# EAGLE design Edge_Con_461 (EAGLE 7.2.0)
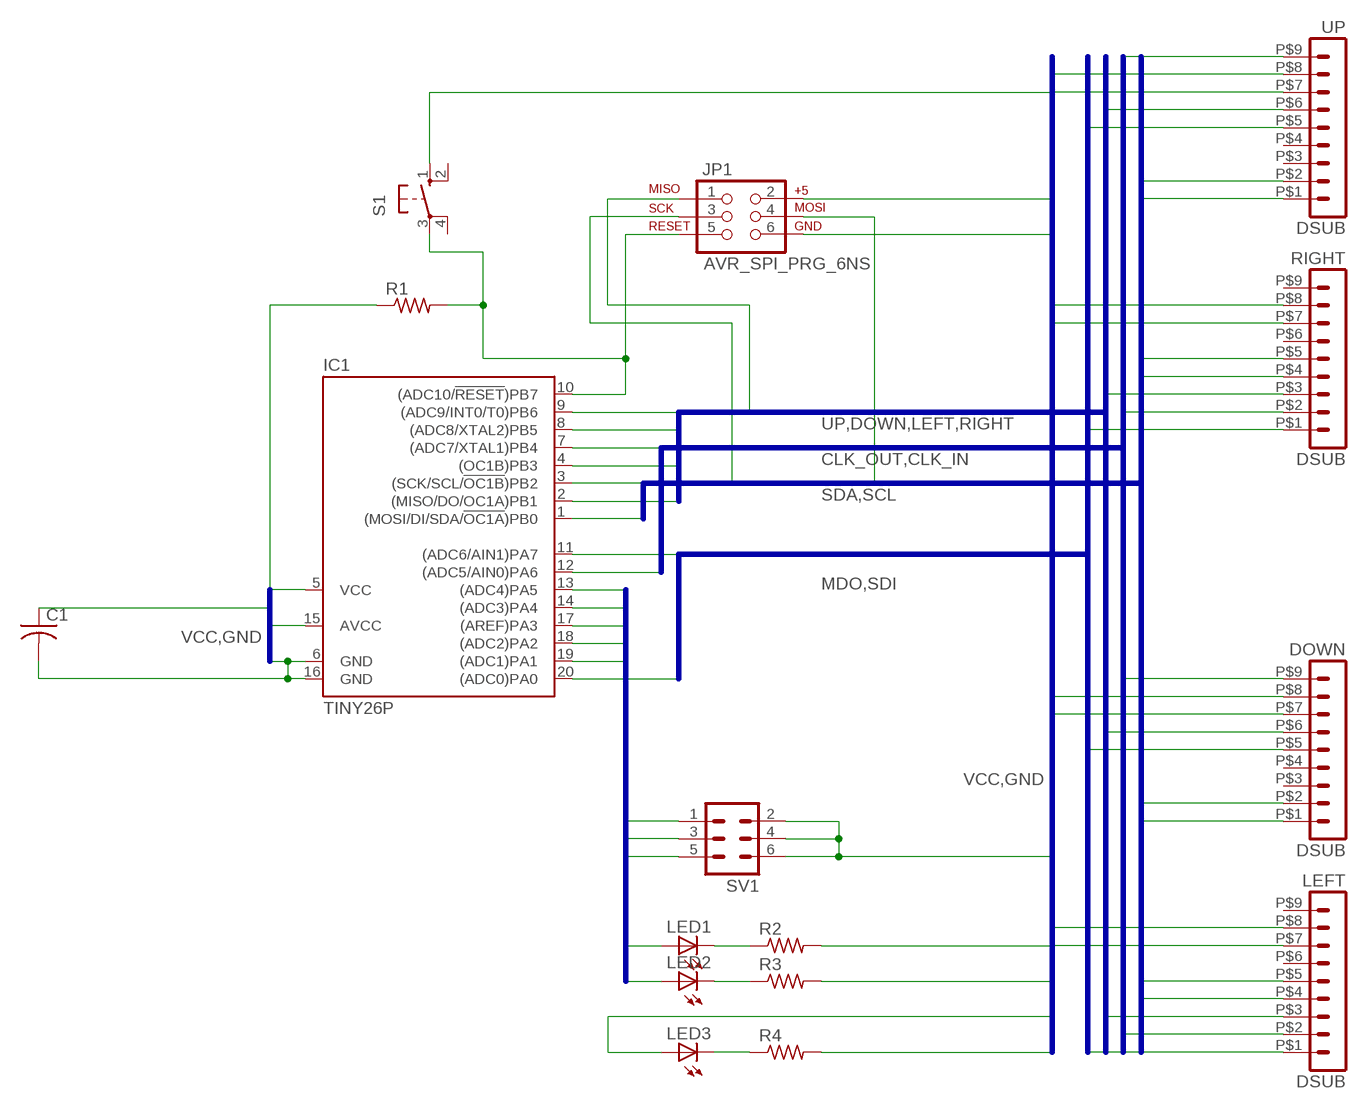
[diagram p0: schematic, sheet 1]

## Parts
C1  C-US025-025X050  [C025-025X050]
DOWN  DSUB  [FOUR]
IC1  TINY26P  [DIL20]
JP1  AVR_SPI_PRG_6NS  [2X3-NS]
LED1  LED3MM  [LED3MM]
LED2  LED3MM  [LED3MM]
LED3  LED3MM  [LED3MM]
LEFT  DSUB  [FOUR]
R1  R-US_0204/5  [0204/5]
R2  R-US_0204/5  [0204/5]
R3  R-US_0204/5  [0204/5]
R4  R-US_0204/5  [0204/5]
RIGHT  DSUB  [FOUR]
S1  10-XX  [B3F-10XX]
SV1  MA03-2  [MA03-2]
UP  DSUB  [FOUR]

## Nets
13: IC1.13((ADC4)PA5) LED1.A
14: IC1.14((ADC3)PA4) LED2.A
17: IC1.17((AREF)PA3) SV1.5
18: IC1.18((ADC2)PA2) SV1.3
19: IC1.19((ADC1)PA1) SV1.1
CLK_IN: DOWN.P$9 IC1.7((ADC7/XTAL1)PB4) LEFT.P$2
CLK_OUT: IC1.12((ADC5/AIN0)PA6) RIGHT.P$2 UP.P$9
DOWN: DOWN.P$6 IC1.4((OC1B)PB3)
GND: C1.2 DOWN.P$7 IC1.6(GND) IC1.16(GND) JP1.6 LEFT.P$7 R2.2 R3.2 R4.2 RIGHT.P$7 S1.1(S) SV1.2 SV1.4 SV1.6 UP.P$7
LEFT: IC1.2((MISO/DO/OC1A)PB1) JP1.1 LEFT.P$3
MDO: IC1.11((ADC6/AIN1)PA7) RIGHT.P$1 UP.P$5
N$1: IC1.10((ADC10/!RESET!)PB7) JP1.5 R1.2 S1.3(P)
N$2: LED3.K(C) R4.1
N$3: LED1.K(C) R2.1
N$4: LED2.K(C) R3.1
RIGHT: IC1.8((ADC8/XTAL2)PB5) RIGHT.P$3
SCL: DOWN.P$2 IC1.3((SCK/SCL/!OC1B!)PB2) JP1.3 LEFT.P$5 RIGHT.P$5 UP.P$2
SDA: DOWN.P$1 IC1.1((MOSI/DI/SDA/!OC1A!)PB0) JP1.4 LEFT.P$4 RIGHT.P$4 UP.P$1
SDI: DOWN.P$5 IC1.20((ADC0)PA0) LEFT.P$1
UP: IC1.9((ADC9/INT0/T0)PB6) UP.P$6
VCC: C1.1 DOWN.P$8 IC1.5(VCC) IC1.15(AVCC) JP1.2 LED3.A LEFT.P$8 R1.1 RIGHT.P$8 UP.P$8
Unconnected: DOWN.P$3 DOWN.P$4 LEFT.P$6 LEFT.P$9 RIGHT.P$6 RIGHT.P$9 S1.2(S1) S1.4(P1) UP.P$3 UP.P$4

## Buses
SDA,SCL
CLK_OUT,CLK_IN
UP,DOWN,LEFT,RIGHT
MDO,SDI
VCC,GND
13,14,16,17,18,19

## Library data of the parts
C1 = rcl:C-US: CAPACITOR, American symbol
DOWN LEFT RIGHT UP = custom:DSUB: Side mount for DB9 connector.
IC1 = atmel:TINY26*: 8-bit AVR Microcontroller with 2K Bytes Flash Source: http://www.atmel.com .. doc1477.pdf; MPN: ATTINY261-20PU; OC_FARNELL: 1455146; OC_NEWARK: 58M3782
JP1 = SparkFun-Connectors:AVR_SPI_PRG_6: AVR ISP 6 Pin This is the reduced ISP connector for AVR programming. Common on Arduino. This footprint will take up less PCB space and can be used with a 10-pin to 6-pin adapter such as SKU: BOB-08508 **Special note about "TEST_POINT" package. The stop mask is on the top side, so if you want your programming test points to be on the bottom of your board, make sure to place this package on the bottom side of the board. This also ensure that the orientation to program from the bottom side will be correct.
LED1-LED3 = led:LED: LED OSRAM: - CHIPLED LG R971, LG N971, LY N971, LG Q971, LY Q971, LO R971, LY R971 LH N974, LH R974 LS Q976, LO Q976, LY Q976 LO Q996 - Hyper CHIPLED LW Q18S LB Q993, LB Q99A, LB R99A - SideLED LS A670, LO A670, LY A670, LG A670, LP A670 LB A673, LV A673, LT A673, LW A673 LH A674 LY A675 LS A676, LA A676, LO A676, LY A676, LW A676 LS A679, LY A679, LG A679 - Hyper Micro SIDELED® LS Y876, LA Y876, LO Y876, LY Y876 LT Y87S - SmartLED LW L88C, LW L88S LB L89C, LB L89S, LG L890 LS L89K, LO L89K, LY L89K LS L896, LA L896, LO L896, LY L896 - TOPLED LS T670, LO T670, LY T670, LG T670, LP T670 LSG T670, LSP T670, LSY T670, LOP T670, LYG T670 LG T671, LOG T671, LSG T671 LB T673, LV T673, LT T673, LW T673 LH T674 LS T676, LA T676, LO T676, LY T676, LB T676, LH T676, LSB T676, LW T676 LB T67C, LV T67C, LT T67C, LS T67K, LO T67K, LY T67K, LW E67C LS E67B, LA E67B, LO E67B, LY E67B, LB E67C, LV E67C, LT E67C LW T67C LS T679, LY T679, LG T679 LS T770, LO T770, LY T770, LG T770, LP T770 LB T773, LV T773, LT T773, LW T773 LH T774 LS E675, LA E675, LY E675, LS T675 LS T776, LA T776, LO T776, LY T776, LB T776 LHGB T686 LT T68C, LB T68C - Hyper Mini TOPLED® LB M676 - Mini TOPLED Santana® LG M470 LS M47K, LO M47K, LY M47K Source: http://www.osram.convergy.de LUXEON: - LUMILED® LXK2-PW12-R00, LXK2-PW12-S00, LXK2-PW14-U00, LXK2-PW14-V00 LXK2-PM12-R00, LXK2-PM12-S00, LXK2-PM14-U00 LXK2-PE12-Q00, LXK2-PE12-R00, LXK2-PE12-S00, LXK2-PE14-T00, LXK2-PE14-U00 LXK2-PB12-K00, LXK2-PB12-L00, LXK2-PB12-M00, LXK2-PB14-N00, LXK2-PB14-P00, LXK2-PB14-Q00 LXK2-PR12-L00, LXK2-PR12-M00, LXK2-PR14-Q00, LXK2-PR14-R00 LXK2-PD12-Q00, LXK2-PD12-R00, LXK2-PD12-S00 LXK2-PH12-R00, LXK2-PH12-S00 LXK2-PL12-P00, LXK2-PL12-Q00, LXK2-PL12-R00 Source: www.luxeon.com KINGBRIGHT: KA-3528ASYC Source: www.kingbright.com
R1-R4 = rcl:R-US_: RESISTOR, American symbol
S1 = switch-omron:10-XX: OMRON SWITCH; MPN: B3F-1000; OC_FARNELL: 176432; OC_NEWARK: 36M3542
SV1 = con-lstb:MA03-2: PIN HEADER; OC_FARNELL: unknown; OC_NEWARK: unknown

## Board
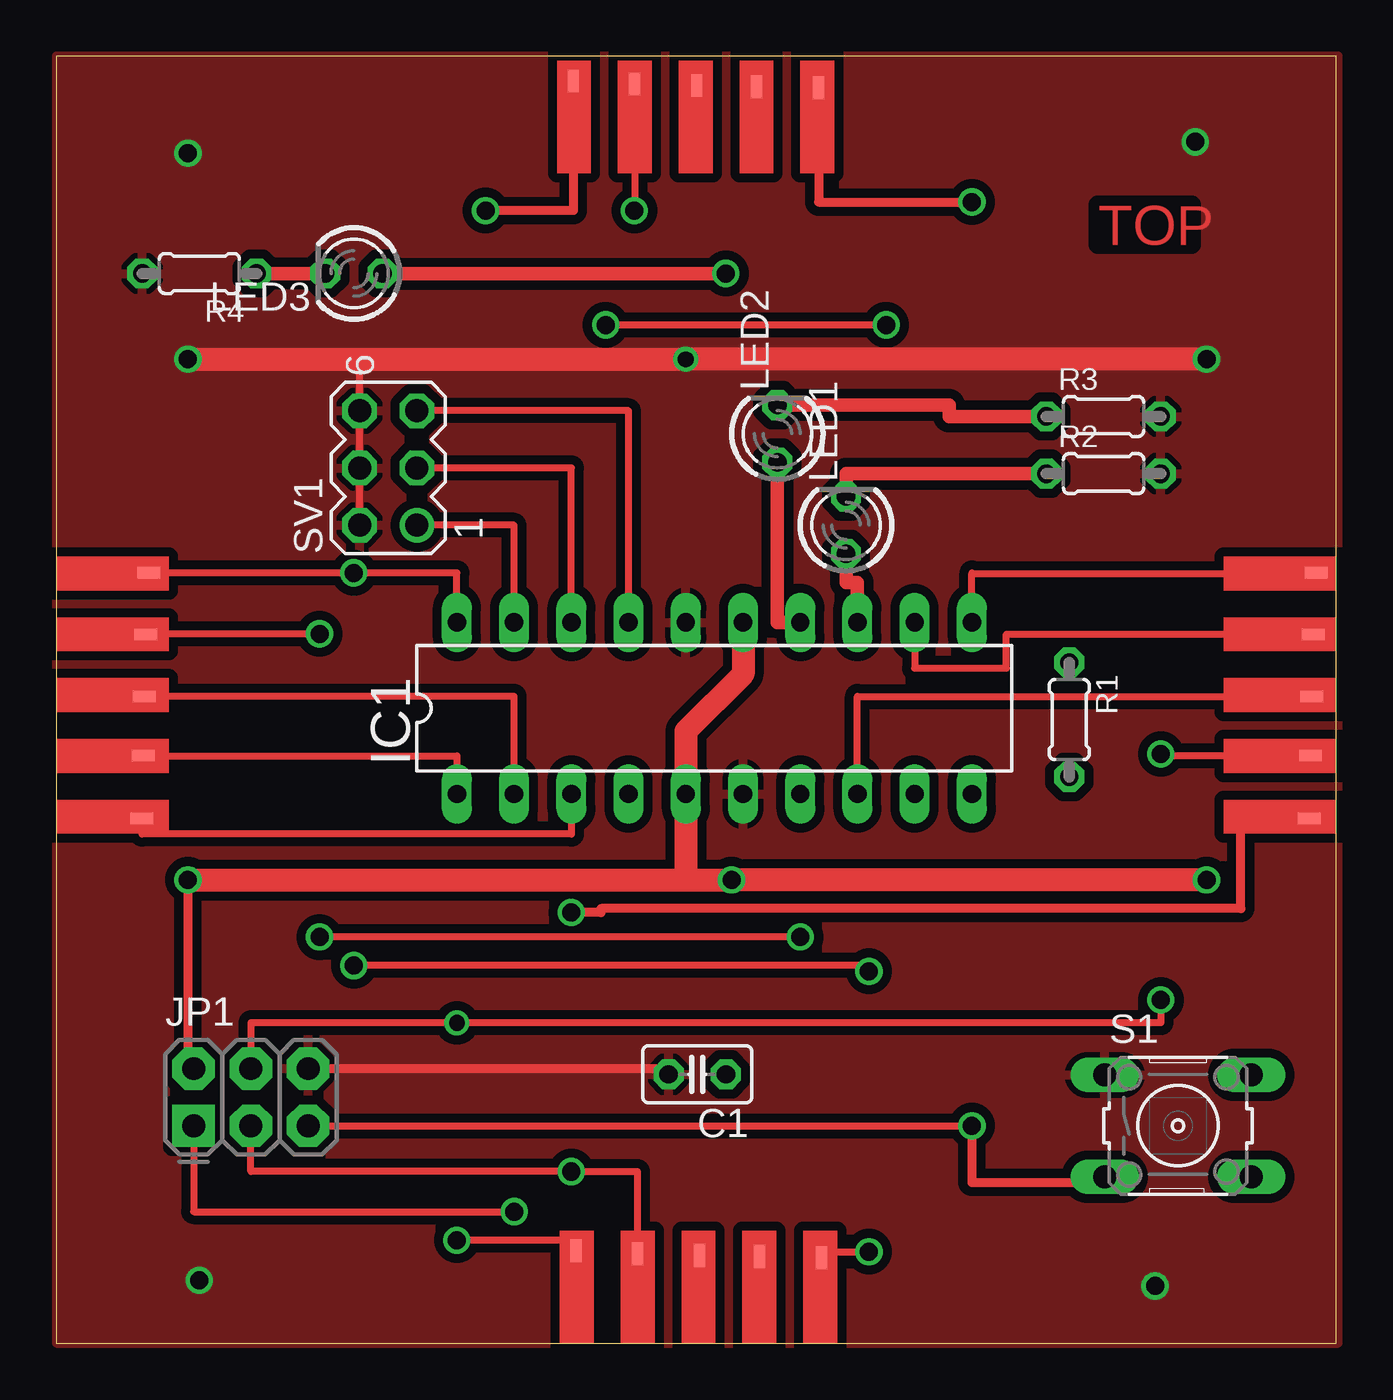
[diagram p1: board, top side]
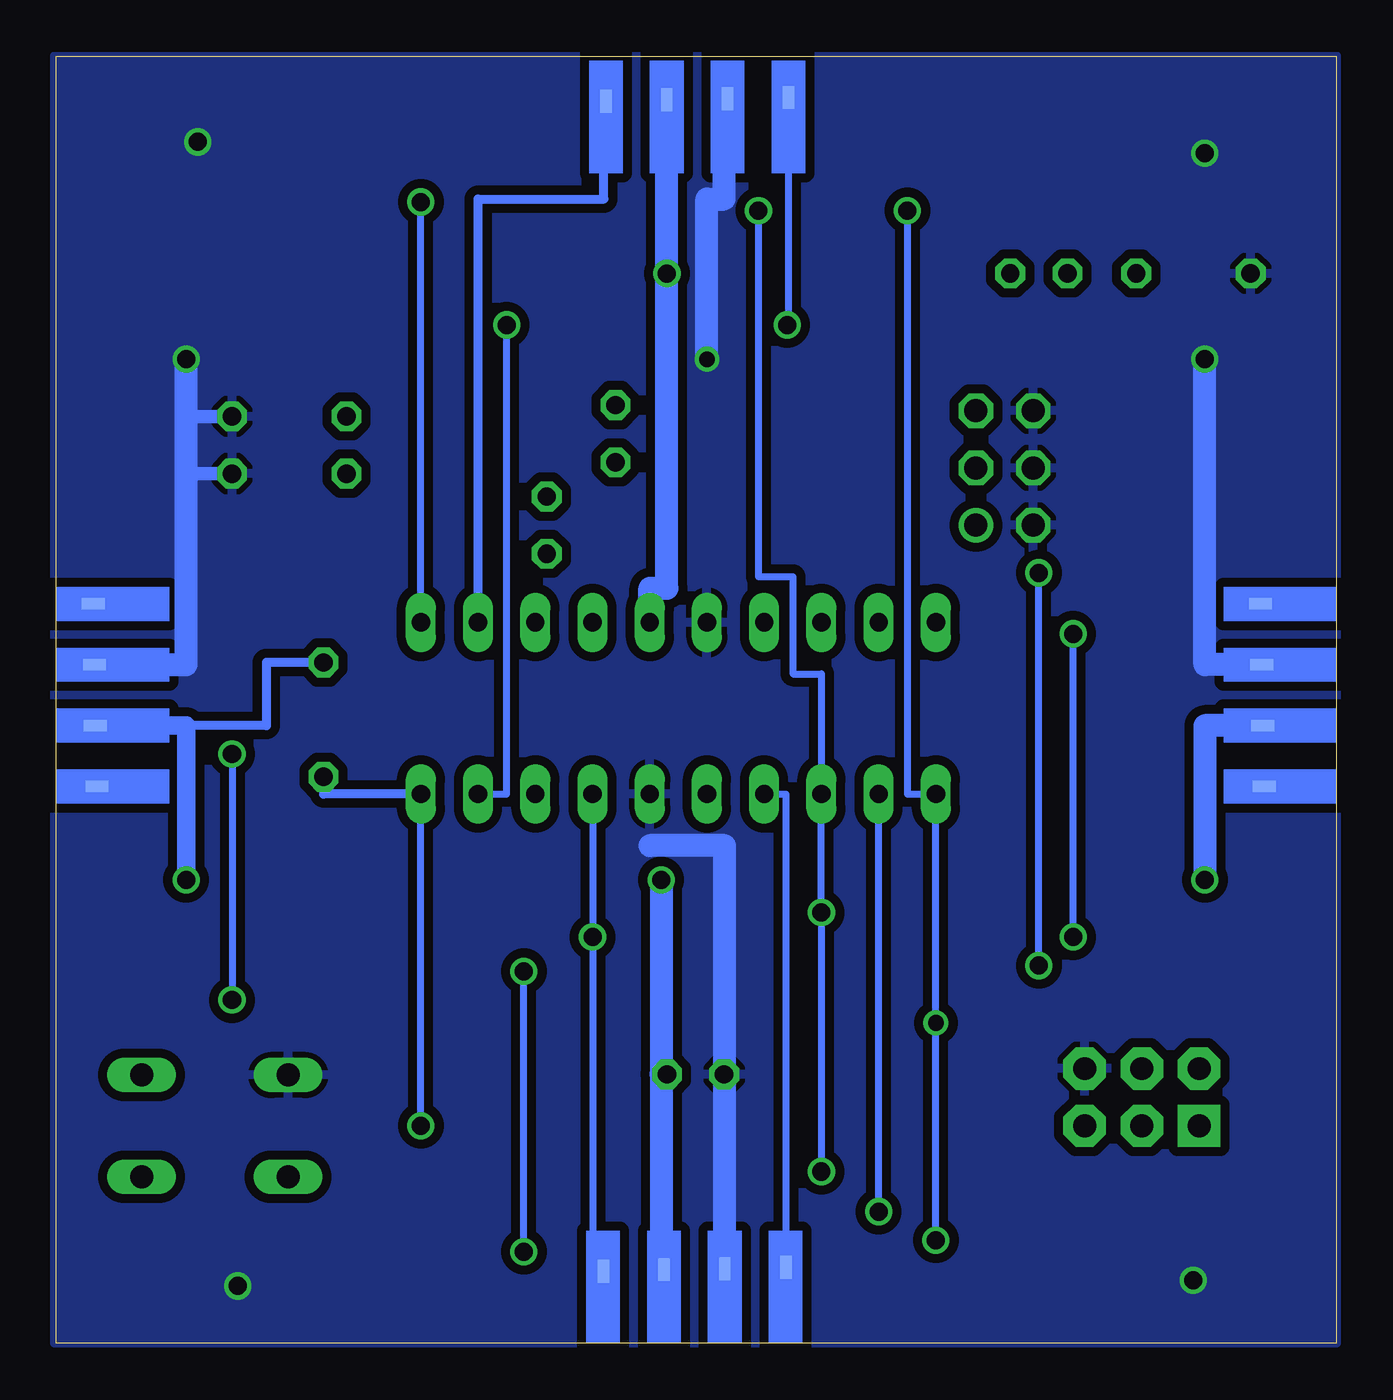
[diagram p2: board, bottom side, seen from below]

Size 56.82 x 57.14 mm. Coordinates in mm from the lower left corner, seen from the top.
Outline: 0,0 56.82,0 56.82,57.14 0,57.14 0,0
Copper layers (1*16): Top 0.035mm / dielectric 1.5mm / Bottom 0.035mm
Design rules "default *": minimum track width 10mil, minimum drill 24mil, track to track 8mil, track to pad 8mil, pad to pad 8mil, via to via 8mil, smd to smd 8mil, copper to edge 0mil, drill to drill 8mil, minimum pad ring 10mil, minimum via ring 8mil, stop-mask expansion 4mil, vias tented up to drill 0mil, thermal gap 10mil

### Footprints (pad centres in the part's own frame; a part is rotated, then mirrored left to right if it is on the bottom)
C025-025X050 = drill 0.813 octagon: 1 -1.27,0; 2 1.27,0
FOUR = smd 0.508 x 1.016: P$1 0.72,4.1; P$2 3.44,3.97; P$3 6.2,3.9; P$4 8.85,3.85; P$5 11.61,3.8 | smd 0.508 x 1.016 bottom: P$6 2.09,3.37; P$7 4.8,3.31; P$8 7.5,3.27; P$9 10.19,3.2
DIL20 = drill 0.813 long: 1 -11.43,-3.81; 2 -8.89,-3.81; 3 -6.35,-3.81; 4 -3.81,-3.81; 5 -1.27,-3.81; 6 1.27,-3.81; 7 3.81,-3.81; 8 6.35,-3.81; 9 8.89,-3.81; 10 11.43,-3.81; 11 11.43,3.81; 12 8.89,3.81; 13 6.35,3.81; 14 3.81,3.81; 15 1.27,3.81; 16 -1.27,3.81; 17 -3.81,3.81; 18 -6.35,3.81; 19 -8.89,3.81; 20 -11.43,3.81
2X3-NS = drill 1.016 pad 1.88 square: 1 -2.54,-1.27 | drill 1.016 pad 1.88 octagon: 2 -2.54,1.27; 3 0,-1.27; 4 0,1.27; 5 2.54,-1.27; 6 2.54,1.27
LED3MM = drill 0.813 octagon: A -1.27,0; K 1.27,0
0204/5 = drill 0.813 octagon: 1 -2.54,0; 2 2.54,0
B3F-10XX = drill 1.016 long: 1 -3.251,2.261; 2 3.251,2.261; 3 -3.251,-2.261; 4 3.251,-2.261
MA03-2 = drill 1.016: 1 -2.54,-1.27 | drill 1.016 octagon: 2 -2.54,1.27; 3 0,-1.27; 4 0,1.27; 5 2.54,-1.27; 6 2.54,1.27

### Placement (x,y rotation side)
C1  28.45,11.94 180 top
DOWN  22.35,0 0 top
IC1  29.21,28.19 0 top
JP1  8.64,10.92 0 top
LED1  35.05,36.32 90 top
LED2  32,40.39 90 top
LED3  13.21,47.5 180 top
LEFT  0,34.92 270 top
R1  44.96,27.69 270 top
R2  46.48,38.61 0 top
R3  46.48,41.15 0 top
R4  6.35,47.5 180 top
RIGHT  51.82,34.92 270 top
S1  49.78,9.65 0 top
SV1  14.73,38.86 90 top
UP  22.23,51.94 0 top

### Tracks (layer width: path | path; a pad name or v marks a point on that pad's centre or on a via)
13
  Top 0.61: LED1.A 35.05,33.78 35.56,33.78 IC1.13
14
  Top 0.61: LED2.A 32,32 IC1.14
17
  Top 0.305: IC1.17 25.4,41.4 SV1.5
18
  Top 0.305: IC1.18 22.86,38.86 SV1.3
19
  Top 0.305: IC1.19 20.32,36.32 SV1.1
CLK_IN  (via drill 0.8)
  Top 0.305: v33.02,18.03 v11.68,18.03 | v11.68,31.5 11.68,31.48 LEFT.P$2
  Bottom 0.305: DOWN.P$9 33.02,3.2 v33.02,18.03 IC1.7 | v11.68,18.03 v11.68,31.5
CLK_OUT
  Top 0.305: IC1.12 38.1,29.97 42.16,29.97 42.16,31.48 RIGHT.P$2
  Bottom 0.406: IC1.12 38.1,50.8 32.51,50.8 32.51,54.1 32.41,54.1 UP.P$9
DOWN
  Bottom 0.305: IC1.4 24.44,24.38 DOWN.P$6
GND  (via drill 0.7, 0.8)
  Top 0.305: SV1.2 SV1.4 SV1.6 13.46,43.69
  Top 0.406: JP1.6 27.18,12.19 | 46.51,11.94 S1.1
  Top 1.016: v5.84,43.69 13.46,43.69 v27.94,43.69 v51.05,43.69
  Bottom 0.61: R3.2 51.05,41.15 | R2.2 51.05,38.61
  Bottom 0.813: 27.18,55.25 UP.P$7
  Bottom 1.016: v27.94,43.69 27.94,50.8 27.18,50.8 27.18,55.25 | LEFT.P$7 5.84,30.12 v5.84,43.69 | RIGHT.P$7 51.05,30.12 51.05,38.61 51.05,41.15 v51.05,43.69 | DOWN.P$7 27.15,11.94 27.15,22.1 30.48,22.1
  other vias: 5.84,52.83 50.55,53.34 48.77,2.54 6.35,2.79
  pour Top (isolate 0.406): 0,0 56.9,0 56.9,0.25 56.9,57.15 0,57.15
  pour Bottom (isolate 0.406): 0,0 56.9,0 56.9,57.15 0,57.15
LEFT  (via drill 0.8)
  Top 0.305: IC1.2 20.32,28.73 LEFT.P$3 | JP1.1 6.1,5.84 v20.32,5.84
  Bottom 0.305: v20.32,5.84 IC1.2
MDO  (via drill 0.8)
  Top 0.305: IC1.11 40.64,34.16 | 40.64,34.2 40.64,34.16 | 40.64,34.16 56.52,34.16 56.52,34.2 RIGHT.P$1
  Top 0.406: UP.P$5 33.84,50.67 v40.64,50.67
  Bottom 0.305: IC1.11 v40.64,50.67
N$1  (via drill 0.8)
  Top 0.305: JP1.5 v40.64,9.65
  Top 0.406: v40.64,9.65 40.64,7.14 46.28,7.14 S1.3
  Bottom 0.305: v40.64,9.65 IC1.10
  Bottom 0.406: IC1.10 44.96,24.38 R1.2
N$2
  Top 0.61: LED3.K R4.1
N$3
  Top 0.61: LED1.K 35.05,38.61 R2.1
N$4
  Top 0.61: R3.1 39.62,41.15 39.62,41.66 LED2.K
RIGHT
  Top 0.305: IC1.8 35.56,28.73 RIGHT.P$3
SCL  (via drill 0.8)
  Top 0.305: IC1.3 22.86,22.61 3.81,22.61 LEFT.P$5 | UP.P$2 25.66,50.29 v25.65,50.29 | DOWN.P$2 25.79,7.62 v22.86,7.62 8.64,7.62 JP1.3
  Top 0.406: RIGHT.P$5 55.62,23.37 52.58,23.37 52.58,19.3 24.18,19.3 24.18,19.13 v22.86,19.13
  Bottom 0.305: v25.65,50.29 25.65,34.04 24.13,34.04 24.13,29.72 22.86,29.72 IC1.3 v22.86,19.13 v22.86,7.62
SDA  (via drill 0.7, 0.8)
  Top 0.305: DOWN.P$1 23.07,4.57 v17.78,4.57 | LEFT.P$4 17.78,26.07 IC1.1 | RIGHT.P$4 49.02,26.07 v49.02,26.16 | v49.02,15.24 49.02,14.22 v17.78,14.22 8.64,14.22 JP1.4 | UP.P$1 22.95,53.09
  Top 0.406: 22.95,53.09 22.95,50.29 v19.05,50.29
  Bottom 0.305: v17.78,4.57 v17.78,14.22 IC1.1 19.05,24.38 v19.05,50.29 | v49.02,26.16 v49.02,15.24
SDI  (via drill 0.8)
  Top 0.305: IC1.20 17.78,34.2 v13.21,34.2 LEFT.P$1 | DOWN.P$5 33.96,4.06 v36.07,4.06 | v36.07,16.51 36.07,16.76 v13.21,16.76
  Bottom 0.305: v36.07,4.06 v36.07,16.51 | v13.21,16.76 v13.21,34.2
UP  (via drill 0.8)
  Top 0.305: v36.83,45.21 v24.38,45.21
  Bottom 0.305: IC1.9 36.83,24.38 v36.83,45.21 | v24.38,45.21 24.32,45.21 UP.P$6
VCC  (via drill 0.8)
  Top 0.406: v5.84,20.57 5.84,12.19 JP1.2
  Top 0.61: LED3.A v29.72,47.5
  Top 0.813: 27.94,20.57 v29.97,20.57
  Top 1.016: IC1.15 30.48,29.72 27.94,27.18 IC1.5 27.94,20.57 | v51.05,20.57 v29.97,20.57 v5.84,20.57
  Bottom 0.406: JP1.2 5.84,12.19 | C1.1 29.97,11.94 | R1.1 47.5,30.23 47.5,27.43 51.05,27.43
  Bottom 0.813: 29.97,3.27 DOWN.P$8 | RIGHT.P$8 51.05,27.43 v51.05,20.57 | 29.72,55.21 UP.P$8
  Bottom 1.016: v29.97,20.57 29.97,11.94 29.97,3.27 | LEFT.P$8 5.84,27.43 v5.84,20.57 | IC1.15 30.48,33.53 29.72,33.53 v29.72,47.5 29.72,55.21

### Text on the board
Top: TOP